# EAGLE design Clamp_Eagle_260901 (EAGLE 9.6.2)
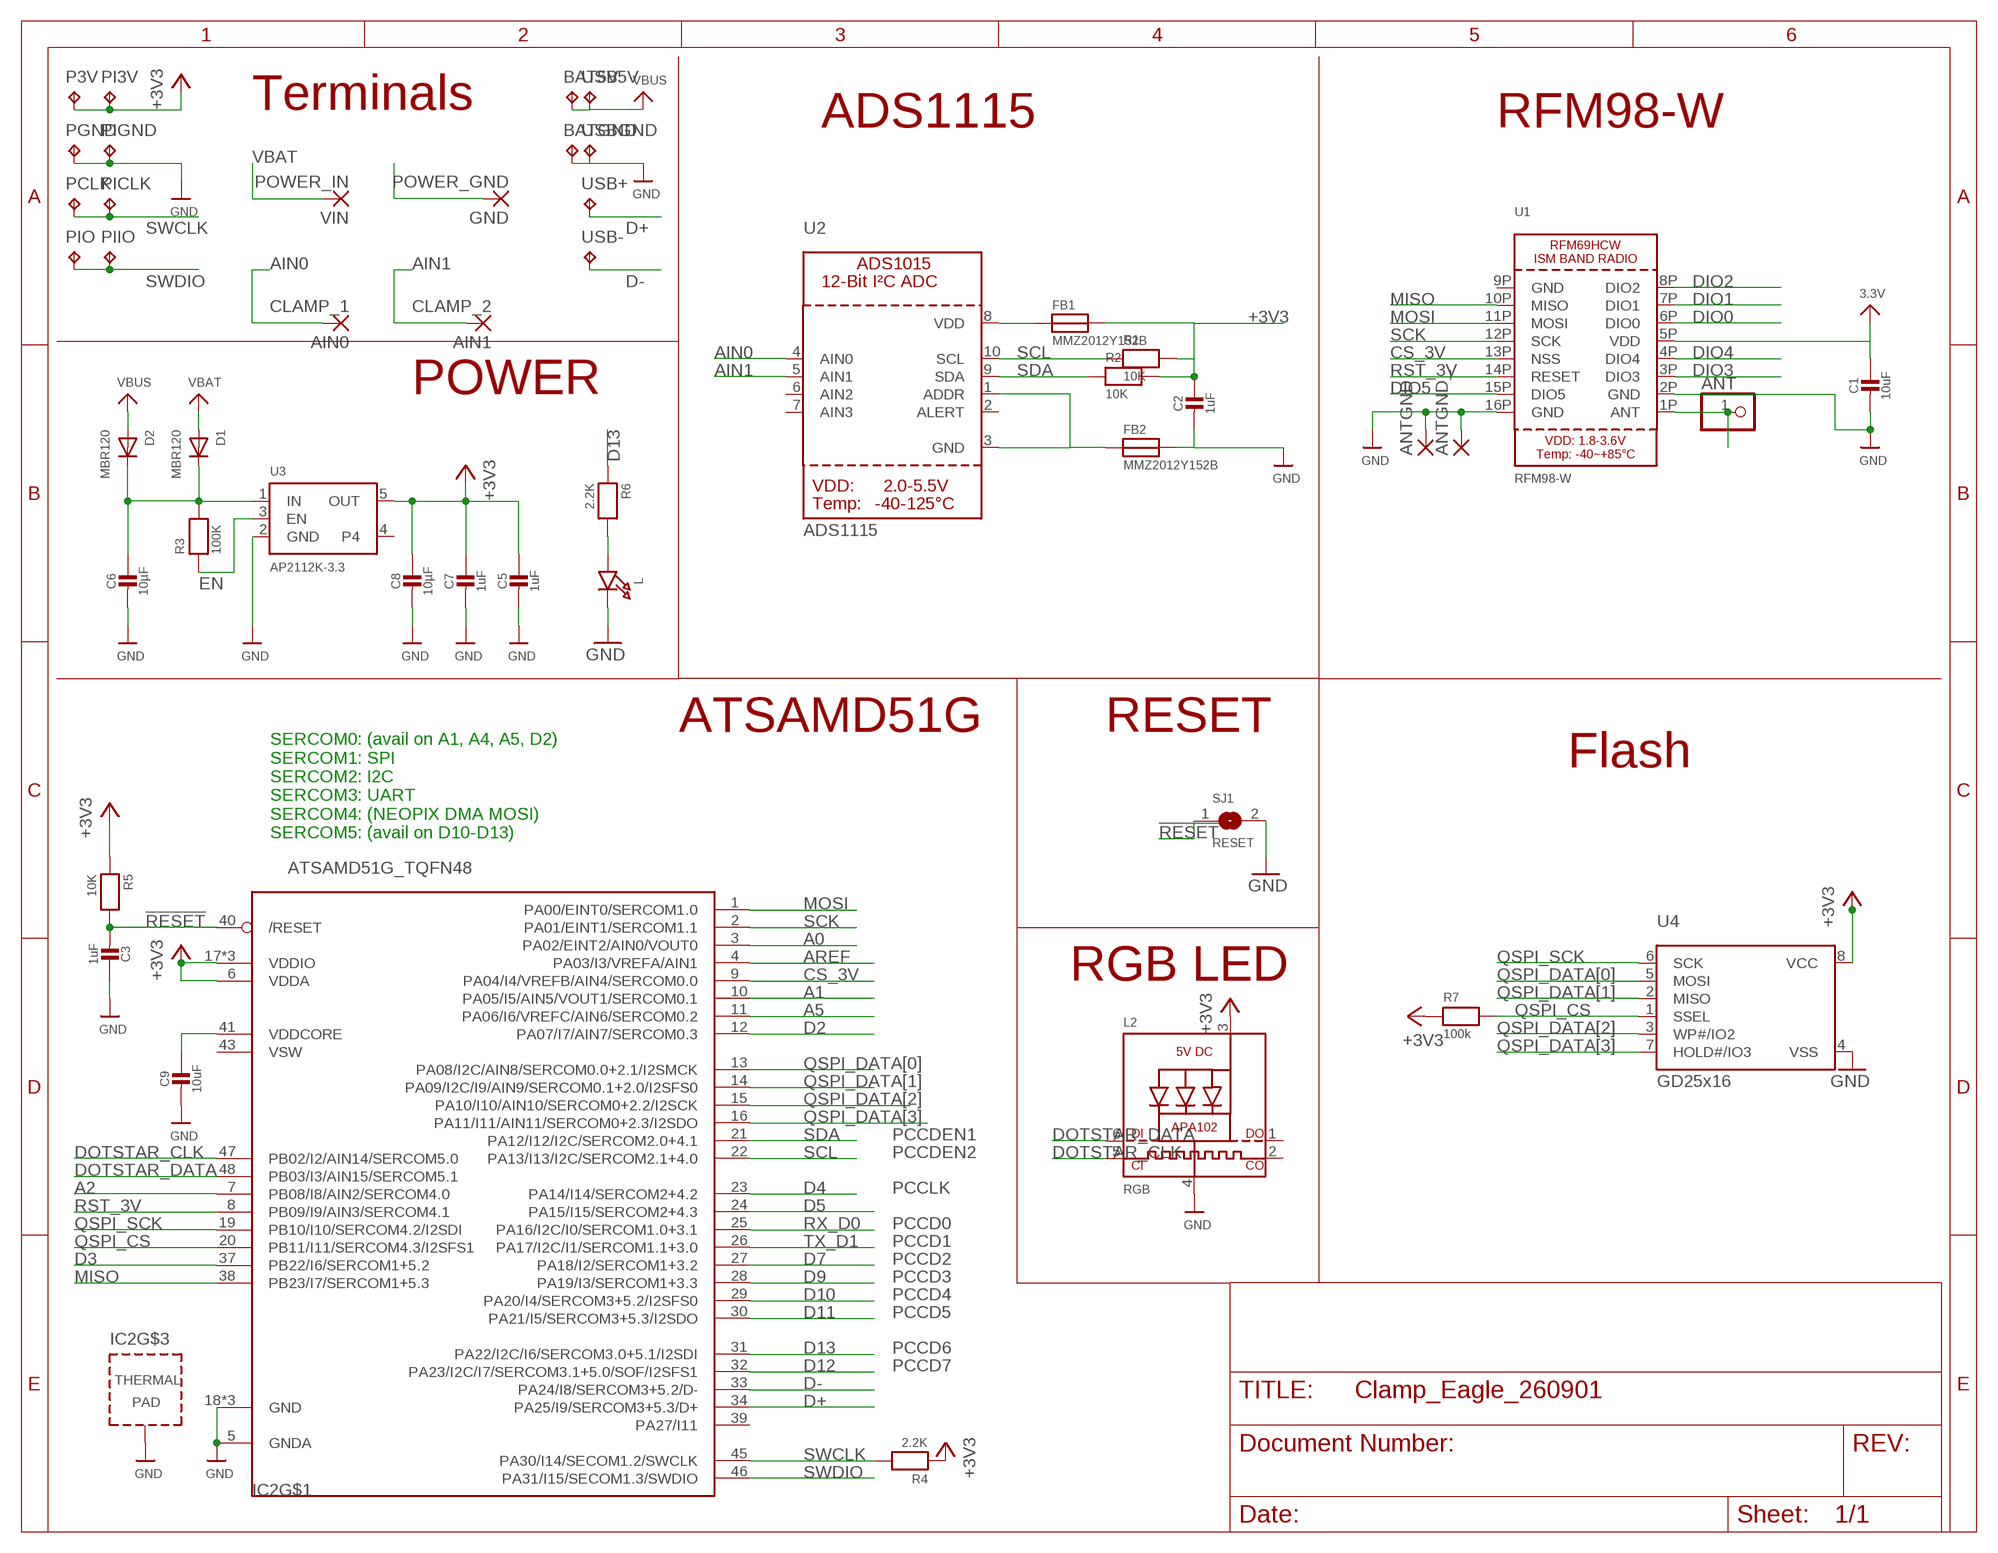
[diagram p0: schematic, sheet 1]

## Parts
AIN0  CLAMP_1  1,6/0,9  [1,6/0,9]
AIN1  CLAMP_2  1,6/0,9  [1,6/0,9]
ANT  HEADER-1X1ROUND  [1X01_ROUND]
ANTGND  SMD5  [SMD2,54-5,08]
ANTGND_  SMD5  [SMD2,54-5,08]
BAT5V  TPPAD1-13  [P1-13]
BATGND  TPPAD1-13  [P1-13]
C1  10uF  CAP_CERAMIC0805-NOOUTLINE  [0805-NO]
C2  1uF  CAP_CERAMIC0603_NO  [0603-NO]
C3  1uF  CAP_CERAMIC_0603MP  [_0603MP]
C5  1uF  CAP_CERAMIC0603_NO  [0603-NO]
C6  10µF  CAP_CERAMIC0805-NOOUTLINE  [0805-NO]
C7  1uF  CAP_CERAMIC0603_NO  [0603-NO]
C8  10µF  CAP_CERAMIC0805-NOOUTLINE  [0805-NO]
C9  10uF  CAP_CERAMIC_0805MP  [_0805MP]
D1  MBR120  DIODE_SOD-123FL  [SOD-123FL]
D2  MBR120  DIODE_SOD-123FL  [SOD-123FL]
FB1  MMZ2012Y152B  FERRITE0805  [0805]
FB2  MMZ2012Y152B  FERRITE0805  [0805]
GND  POWER_GND  1,6/0,9  [1,6/0,9]
IC2  ATSAMD51G_TQFN48  [TQFN48_7MM]
L  LED0603_NOOUTLINE  [CHIPLED_0603_NOOUTLINE]
L2  RGB  APA1022020  [APA102_2020]
P3V  TPTP20R  [TP20R]
PCLK  TPTP20R  [TP20R]
PGND  TPTP20R  [TP20R]
PI3V  TPPAD1-13  [P1-13]
PICLK  TPPAD1-13  [P1-13]
PIGND  TPPAD1-13  [P1-13]
PIIO  TPPAD1-13  [P1-13]
PIO  TPTP20R  [TP20R]
R1  10K  RESISTOR0805  [0805]
R2  10K  RESISTOR0805  [0805]
R3  100K  RESISTOR0805  [0805]
R4  2.2K  RESISTOR0805  [0805]
R5  10K  RESISTOR0805  [0805]
R6  2.2K  RESISTOR0805  [0805]
R7  100k  RESISTOR0805  [0805]
SJ1  RESET  SOLDERJUMPERCLOSED  [SOLDERJUMPER_CLOSEDWIRE]
U1  RFM98-W  RFM69HCW_SMT  [RFMHCW_SMT]
U2  ADS1115  ADC_ADS1015  [MSOP10]
U3  AP2112K-3.3  VREG_SOT23-5  [SOT23-5]
U4  GD25x16  SPIFLASH_8PINUX  [USON8]
USB5V  TPPAD1-13  [P1-13]
USB+  TPPAD1-13  [P1-13]
USB-  TPPAD1-13  [P1-13]
USBGND  TPPAD1-13  [P1-13]
VIN  POWER_IN  1,6/0,9  [1,6/0,9]

## Nets
!RESET: C3.2 IC2.40(/RESET) R5.2 SJ1.1
+3V3: C1.1 C2.1 C5.1 C7.1 C8.1 FB1.2 IC2.6(VDDA) IC2.17(VDDIO) IC2.36(VDDIO) IC2.44(VDDIO) L2.3(VDD) P3V.TP PI3V.TP R1.2 R2.2 R4.1 R5.1 R7.1 U1.5P(VDD) U3.5(OUT) U4.8(VCC) ; supply symbol labelled 3.3V
A0: IC2.3(PA02/EINT2/AIN0/VOUT0)
A1: IC2.10(PA05/I5/AIN5/VOUT1/SERCOM0.1)
A2: IC2.7(PB08/I8/AIN2/SERCOM4.0)
A5: IC2.11(PA06/I6/VREFC/AIN6/SERCOM0.2)
AIN0: AIN0.1(P) U2.4(AIN0)
AIN1: AIN1.1(P) U2.5(AIN1)
AREF: IC2.4(PA03/I3/VREFA/AIN1)
CS_3V: IC2.9(PA04/I4/VREFB/AIN4/SERCOM0.0) U1.13P(NSS)
D2: IC2.12(PA07/I7/AIN7/SERCOM0.3)
D3: IC2.37(PB22/I6/SERCOM1+5.2)
D4: IC2.23(PA14/I14/SERCOM2+4.2)
D5: IC2.24(PA15/I15/SERCOM2+4.3)
D7: IC2.27(PA18/I2/SERCOM1+3.2)
D9: IC2.28(PA19/I3/SERCOM1+3.3)
D10: IC2.29(PA20/I4/SERCOM3+5.2/I2SFS0)
D11: IC2.30(PA21/I5/SERCOM3+5.3/I2SDO)
D12: IC2.32(PA23/I2C/I7/SERCOM3.1+5.0/SOF/I2SFS1)
D13: IC2.31(PA22/I2C/I6/SERCOM3.0+5.1/I2SDI) R6.1
D+: IC2.34(PA25/I9/SERCOM3+5.3/D+) USB+.TP
D-: IC2.33(PA24/I8/SERCOM3+5.2/D-) USB-.TP
DIO0: U1.6P(DIO0)
DIO1: U1.7P(DIO1)
DIO2: U1.8P(DIO2)
DIO3: U1.3P(DIO3)
DIO4: U1.4P(DIO4)
DIO5: U1.15P(DIO5)
DOTSTAR_CLK: IC2.47(PB02/I2/AIN14/SERCOM5.0) L2.5(CKI)
DOTSTAR_DATA: IC2.48(PB03/I3/AIN15/SERCOM5.1) L2.6(DI)
EN: R3.1 U3.3(EN)
GND: ANTGND.1(P) ANTGND_.1(P) BATGND.TP C1.2 C2.2 C3.1 C5.2 C6.2 C7.2 C8.2 C9.2 FB2.2 GND.1(P) IC2.5(GNDA) IC2.18(GND) IC2.35(GND) IC2.42(GND) IC2.THERMAL(TP) L2.4(GND) L.C PGND.TP PIGND.TP SJ1.2 U1.2P(GND) U1.16P(GND) U3.2(GND) U4.4(VSS) USBGND.TP
GND_IN: FB2.1 U2.1(ADDR) U2.3(GND)
MISO: IC2.38(PB23/I7/SERCOM1+5.3) U1.10P(MISO)
MOSI: IC2.1(PA00/EINT0/SERCOM1.0) U1.11P(MOSI)
N$1: ANT.1 U1.1P(ANT)
N$2: L.A R6.2
N$3: FB1.1 U2.8(VDD)
QSPI_CS: IC2.20(PB11/I11/SERCOM4.3/I2SFS1) R7.2 U4.1(SSEL)
QSPI_DATA[0]: IC2.13(PA08/I2C/AIN8/SERCOM0.0+2.1/I2SMCK) U4.5(MOSI)
QSPI_DATA[1]: IC2.14(PA09/I2C/I9/AIN9/SERCOM0.1+2.0/I2SFS0) U4.2(MISO)
QSPI_DATA[2]: IC2.15(PA10/I10/AIN10/SERCOM0+2.2/I2SCK) U4.3(WP#/IO2)
QSPI_DATA[3]: IC2.16(PA11/I11/AIN11/SERCOM0+2.3/I2SDO) U4.7(HOLD#/IO3)
QSPI_SCK: IC2.19(PB10/I10/SERCOM4.2/I2SDI) U4.6(SCK)
RST_3V: IC2.8(PB09/I9/AIN3/SERCOM4.1) U1.14P(RESET)
RX_D0: IC2.25(PA16/I2C/I0/SERCOM1.0+3.1)
SCK: IC2.2(PA01/EINT1/SERCOM1.1) U1.12P(SCK)
SCL: IC2.22(PA13/I13/I2C/SERCOM2.1+4.0) R1.1 U2.10(SCL)
SDA: IC2.21(PA12/I12/I2C/SERCOM2.0+4.1) R2.1 U2.9(SDA)
SWCLK: IC2.45(PA30/I14/SECOM1.2/SWCLK) PCLK.TP PICLK.TP R4.2
SWDIO: IC2.46(PA31/I15/SECOM1.3/SWDIO) PIIO.TP PIO.TP
TX_D1: IC2.26(PA17/I2C/I1/SERCOM1.1+3.0)
VBAT: D1.A VIN.1(P)
VBUS: BAT5V.TP D2.A USB5V.TP
VDDCORE: C9.1 IC2.41(VDDCORE)
VHI: C6.1 D1.C D2.C R3.2 U3.1(IN)
Unconnected: IC2.39(PA27/I11) L2.1(DO) L2.2(CKO) U2.2(ALERT) U2.6(AIN2) U2.7(AIN3) U3.4

## Notes on the sheet
- Terminals
- ADS1115 | RFM98-W
- POWER
- ATSAMD51G | RESET
- Flash
- SERCOM0: (avail on A1, A4, A5, D2)
  SERCOM1: SPI
  SERCOM2: I2C
  SERCOM3: UART
  SERCOM4: (NEOPIX DMA MOSI)
  SERCOM5: (avail on D10-D13)
- RGB LED
- PCCDEN1
- PCCDEN2
- PCCLK
- PCCD0
- PCCD1
- PCCD2
- PCCD3
- PCCD4
- PCCD5
- PCCD6
- PCCD7

## Power pins joined to a net without a drawn wire
GND: U1.9P(GND)
VSW: IC2.43(VSW)

## Library data of the parts
AIN0 AIN1 GND VIN = wirepad:1,6/0,9: THROUGH-HOLE PAD
ANT = microbuilder:HEADER-1X1: PIN HEADER
ANTGND ANTGND_ = wirepad:SMD5: SMD PAD
BAT5V BATGND P3V PCLK PGND PI3V PICLK PIGND PIIO PIO USB5V USB+ USB- USBGND = testpad:TP: Test pad
C1-C3 C5-C9 = microbuilder:CAP_CERAMIC: Ceramic Capacitors For new designs, use the packages preceded by an '_' character since they are more reliable: The following footprints should be used on most boards: _0402 - Standard footprint for regular board layouts _0603 - Standard footprint for regular board layouts _0805 - Standard footprint for regular board layouts _1206 - Standard footprint for regular board layouts For extremely tight-pitch boards where space is at a premium, the following 'micro-pitch' footprints can be used (smaller pads, no silkscreen outline, etc.): _0402MP - Micro-pitch footprint for very dense/compact boards _0603MP - Micro-pitch footprint for very dense/compact boards _0805MP - Micro-pitch footprint for very dense/compact boards _1206MP - Micro-pitch footprint for very dense/compact boards
D1 D2 = adafruit:DIODE: Diode SMADIODE - SMA Surface Mount Package 20V 1A Schottky Diode Digikey: 641-1014-6-ND DO-1N4148 - Through Hole Small Current Diode SOD-123 20V 1 A (.5mV Vf) Schottky Diode - Digikey: MBRX120TPMSCT-ND SOD-323 10V 570mA (.38mV Vf, 3ns) Schottky Diode - Digikey: ZLLS410CT-ND SOD-523 30V 30mA Schottky Diode (RB751S-40TE61) - Digikey: RB751S-40TE61CT-ND SOT23-R/W - SOT23 Package (R = Solder Paste/Reflow Ovens, W = Hand-Soldering) BAT54Film 40V 300mA - Digikey: 497-7162-1-ND
FB1 FB2 = microbuilder:FERRITE: Ferrite Bead 0603 MMZ1608B121C - 120 Ohm, 600mA Ferrite Chip - Digikey: 445-2164-1-ND BK1608HW121-T - 120 Ohm, 600mA Ferrite Chip - Digikey: 587-1876-2-ND 0805 HZ0805B272R-10 - 2.7K Ohm @ 100MHz, 200mA 0.8 Ohm DC Resistance - Digikey: 240-2504-1-ND (see also Murata BLM21BD272SN1L)
IC2 = microbuilder:ATSAMD51G
L = microbuilder:LED: LED 0603 - 0603 Surface Mount Package 2mA: Green LED - Low Power (3.9mcd, 2ma, 1.7Vf) - Digikey: 475-2709-2-ND Orange LED - Low Power (9.8mcd, 2ma, 1.8Vf) - Digikey: 475-1194-2-ND Red LED - Low Power (5mcd, 2ma, 1.8Vf) - Digikey: 475-1195-2-ND Yellow LED - Low Power (7mcd, 2ma, 1.8Vf) - Digikey: 475-1196-2-ND 5mA: Blue LED - Low Power (17mcd, 5ma, 2.9Vf) - Digikey: LNJ937W8CRACT-ND 0805 - 0805 Surface Mount Package 2mA: Red LED (8.8mcd, 2mA, 1.8Vf, Clear) - Low Power [Digikey: 475-2510-1-ND] Green LED (5mcd, 2mA, 1.8Vf, Clear) - Low Power [Digikey: 475-2730-1-ND] Yellow LED (11.3mcd, 2mA, 1.8Vf, Clear) - Low Power [Digikey: 475-2555-1-ND] 20mA: Red LED (104mcd, 20mA, Diffused) - LS R976 [Digikey: 475-1278-6-ND] Red LED (12mcd, 20mA, 2.0Vf, Clear) - APT2012EC [Digikey: 754-1128-1-ND] Green LED (15mcd, 20mA, 2.2Vf, Clear) - APT2012GC [Digikey: 754-1131-1-ND] Orange LED (160mcd, 20mA, 2.1Vf, Clear) - APT2012SECK [Digikey: 754-1130-1-ND] 1206 - 1206 Surface Mount Package Green LED (26mcd, 20mA, Diffused) - LG N971 [Digikey: 475-1407-6-ND] Red LED (15mcd, 20mA, Diffused) - LH N974 [Digikey: 475-1416-6-ND] Cree - Cree High-Power Surface Mount LEDs XPEBWT-L1-0000-00D50 - White 111lm 350mA 2.9Vf 6200K 110° XTEAWT-00-0000-00000LEE3 - White 114lm 350mA 2.85Vf 5000K 115° Everlight - Everlight 45-21 Series Surface Mount LEDs 45-21/QK2C-B2832AC2CB2/2T - Warm White 2000mcd 20mA 3.25Vf 3050K 120° 45-21/LK2C-B38452C4CB2/2T - Nuetral White 2000mcd 20mA 3.25Vf 4150K 120° 45-21/LK2C-B50634C6CB2/2T - Cold White 2200mcd 20mA 3.25Vf 5650K 120° PLCC2 Reverse Mount LS T77K-J1L2-1-0-2-R18-Z - Red 11.25mcd 2mA 1.8Vf 630nm 120° LO T77K-L1M2-24-Z - Orange 19.6mcd 2mA 1.8Vf 606nm 120° LY T77K-K2M1-26-Z - Yellow 15.7mcd 2mA 1.8Vf 587nm 120°
L2 = microbuilder:APA102: APA102/DotStar Pixels VCC: 5V DC Refresh Rate: 400Hz
R1-R7 = microbuilder:RESISTOR: Resistors 0402 - 0402 Surface Mount Package 22 Ohm 1% 1/16W [Digikey: 311-22.0LRTR-ND] 33 Ohm 5% 1/16W 1.0K 5% 1/16W 1.5K 5% 1/16W 2.0K 1% 1/16W 10.0K 1% 1/16W [Digikey: 311-10.0KLRTR-ND] 10.0K 5% 1/16W [Digikey: RMCF0402JT10K0TR-ND] 12.1K 1% 1/16W [Digikey: 311-22.0LRTR-ND] 100.0K 5% 1/16W 0603 - 0603 Surface Mount Package 0 Ohm 1/10 Watt 1% Resistor 15 Ohm 1/10 Watt 1% Resistor 33 Ohm 1/10 Watt 1% Resistor 49.9 Ohm 1/10 Watt 1% Resistor 100 Ohm 1/10 Watt 1% Resistor 150 Ohm 1/10 Watt 1% Resistor 240 Ohm 1/10 Watt 1% Resistor 390 Ohm 1/10 Watt 1% Resistor 560 Ohm 1/10 Watt 1% Resistor 680 Ohm 1/10 Watt 1% Resistor 750 Ohm 1/10 Watt 1% Resistor 1.0K Ohm 1/10 Watt 1% Resistor 1.5K Ohm 1/10 Watt 1% Resistor 2.0K Ohm 1/10 Watt 1% Resistor 2.2K Ohm 1/10 Watt 1% Resistor 3.3K Ohm 1/10 Watt 1% Resistor 4.7K Ohm 1/10 Watt 1% Resistor 10.0K Ohm 1/10 Watt 1% Resistor 12.0K Ohm 1/10 Watt 1% Resistor 12.1K Ohm 1/10 Watt 1% Resistor 20.0K Ohm 1/10 Watt 1% Resistor 33.0K Ohm 1/10 Watt 1% Resistor 100.0K Ohm 1/10 Watt 1% Resistor 0805 - 0805 Surface Mount Package 0 Ohm 1/8 Watt 1% Resistor 33 Ohm 1/8 Watt 1% Resistor 100 Ohm 1/8 Watt 1% Resistor 150 Ohm 1/8 Watt 1% Resistor 200 Ohm 1/8 Watt 1% Resistor 240 Ohm 1/8 Watt 1% Resistor 330 Ohm 1/8 Watt 1% Resistor 390 Ohm 1/8 Watt 1% Resistor 470 Ohm 1/8 Watt 1% Resistor 1.0K Ohm 1/8 Watt 1% Resistor 1.5K Ohm 1/8 Watt 1% Resistor 2.0K Ohm 1/8 Watt 1% Resistor 4.7K Ohm 1/8 Watt 1% Resistor 5.1K Ohm 1/8 Watt 1% Resistor 5.6K Ohm 1/8 Watt 1% Resistor 10.0K Ohm 1/8 Watt 1% Resistor 22.0K Ohm 1/8 Watt 1% Resistor 33.0K Ohm 1/8 Watt 1% Resistor 100K Ohm 1/8 Watt 1% Resistor 1206 - 1206 Surface Mount Package 2012 - 2010 Surface Mount Package 0.11 Ohm 1/2 Watt 1% Resistor - Digikey: RHM.11UCT-ND
SJ1 = microbuilder:SOLDERJUMPER: SMD Solder JUMPER Solder the two pads together to create a connection, or remove the solder to break it. REFLOW - Use this footprint for solder paste and reflow ovens. WAVE - Use this footprint for hand-soldering (larger pads). CLOSED - Has a trace between the two pads to ensure it is closed by default. The trace needs to be cut to disable the jumper, and can be closed again by creating a solder bridge between the two pads.
U1 = microbuilder:RFM69HCW: RFM69HCW - ISM Band RF Transceiver
U2 = microbuilder:ADC_ADS1015: ADS1015 - 12-bit 4-Channel I2C ADC with Internal PGA VDD: 2.0-5.5V Sampling Rate: 3.3ksps Gain Settings: 2/3, 1, 2, 4, 8, 16 I2C Address: ADDR low = 1001000x, ADDR high = 1001001x Internal Comparator The ADS1015 includes an internal comparator that can be set to output a high-level on ALERT when the conversion results exceeeds a pre-defined upper level, and will deassert itself when the level falls below a pre-defined lower threshold level. It can also be set to windowed mode where the ALERT pin will be asserted if the data exceeds the upper threshold or falls below the lower threshold.
U3 = microbuilder:VREG_SOT23-5: SOT23-5 Fixed Voltage Regulators Part Current Out V Out V In V Dropout θJA (°C/W) TJ (°C) Digikey Part No. ADP121 150mA 3.3V 3.4-5.5V 0.09V @ 150mA -- -- ADP121-AUJZ33R7CT-ND ADP121 150mA 3.0V 3.1-5.5V 0.09V @ 150mA -- -- ADP121-AUJZ30R7CT-ND ADP122 300mA 3.3V 3.4-5.5V 0.085V @ 300mA -- -- ADP122AUJZ-3.3-R7CT-ND ADP1712 300mA 3.3V 3.5-5.5V 0.17V @ 300mA -- -- ADP1712AUJZ-3.3-R7TR-ND AP7311 (Low Cost) 150mA 3.3V 3.5-6V 0.15V @ 150mA -- -- AP7311-33WG-7DICT-ND LD39015M18R 150mA 1.8V 1.9V-5.5V 0.08V @ 100mA -- -- 497-6977-1-ND LP2985A-33DBVR 150mA 3.3V 3.3-16V 0.28V @ 150mA 206 150 296-18479-1-ND MCP1824T-3302E/OT 300mA 3.3V 3.5V-6V 0.2V @ 300mA -- -- MCP1824T-3302E/OTCT-ND MIC5205-2.5YM5 TR 150mA 2.5V 2.7-16V 0.165V @ 150mA -- -- 576-1257-2-ND MIC5205-3.0YM5 TR 150mA 3.0V 3.2V-16V 0.165V @ 150mA -- -- 576-1258-2-ND MIC5205-3.3YM5 TR 150mA 3.3V 3.5V-16V 0.165V @ 150mA -- -- 576-1259-2-ND TPS780330220 150mA 3.3V+2.2V 3.6-5.5V 250mV Max -- -- 296-23332-1-ND TDA3663/N1,135 100mA 3.3V 3.5-45V 0.18V @ 50mA -- -- 568-5343-1-ND Max operating temp can be calculated using θJA, TJ (max junction temperature), and power in watts. Set the "Maximum Ambient Temperature" until it reaches TJ ("Max Junction Temperature"), which is the absolute limit for safe use of the regulator: Heat Sink Temperature Calculator <http://www.daycounter.com/Calculators/Heat-Sink-Temperature-Calculator.phtml> For example, With 12V source into a 3.3V LP2985 and a 30mA load, we are dissipating (12V-3.3V) * 0.03A = 0.261W. With a θJA of 206 °C/W, a TJ of 150°C, and 261mW we can safely use the chip without a heat sink up to 75°C (=147.1°C Junction Temperature).
U4 = microbuilder:SPIFLASH_8PIN: SOIC8 SPI Flash Be careful with the size since SOIC8 flash comes in several 'widths' SOIC8 150 mil M25P16 - 16Mbit (2Mbit x 8) Serial Flash (75MHz SPI Bus), Supply: 2.7-3.6V Digikey: SOIC8 - M25P16-VMN6P-ND SOIC8 208 mil W25Q16BVSSIG - 16Mbit (2Mbit x 8) Serial Flash (104MHz SPI Bus), Supply: 2.7-3.6V Digikey: SOIC8 - W25Q16BVSSIG-ND

## Board
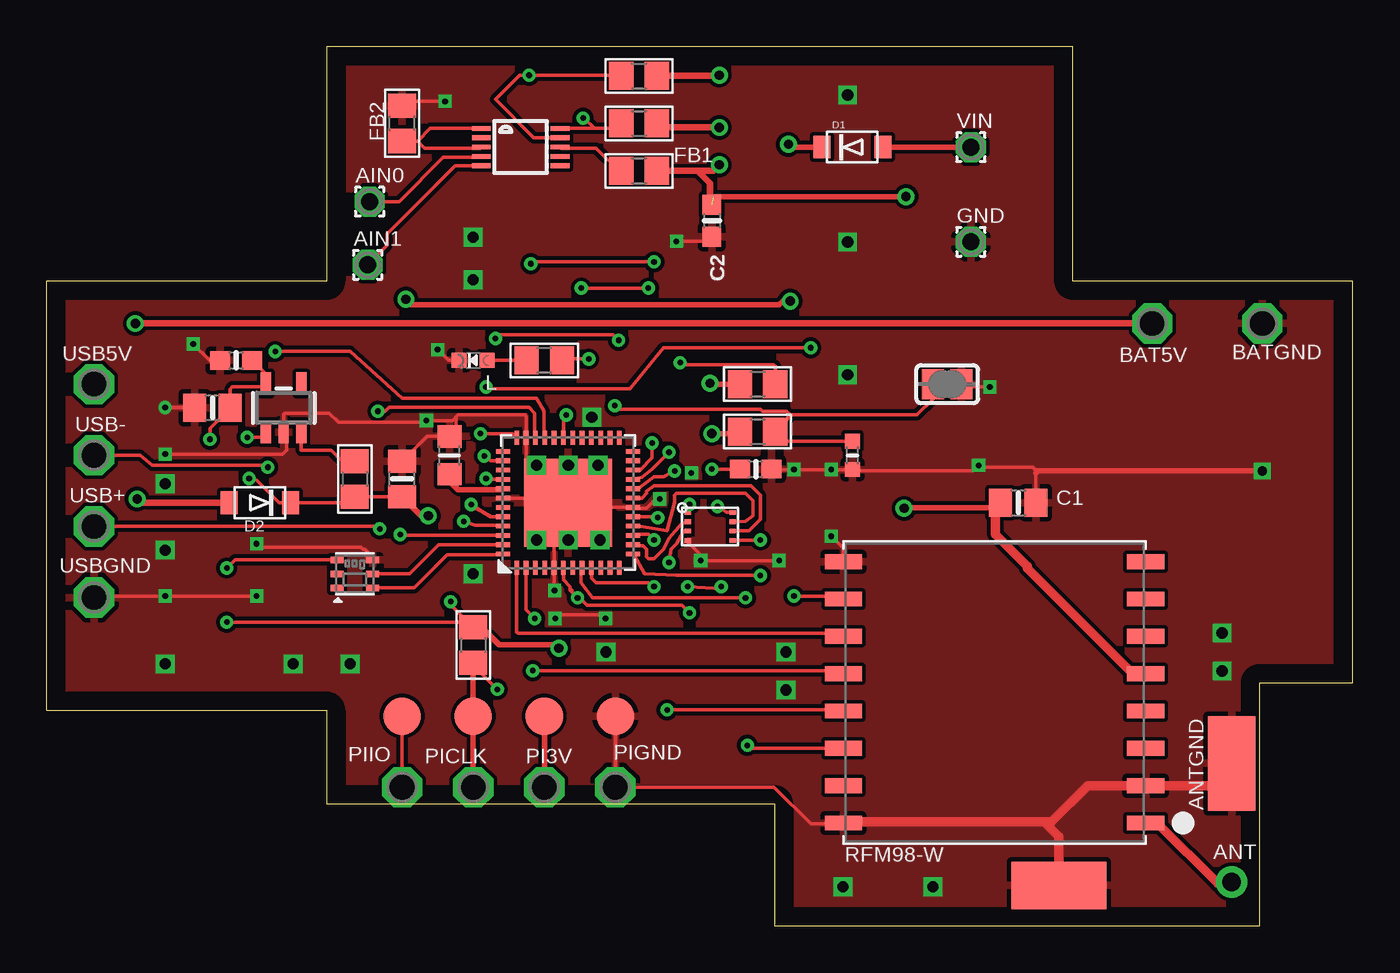
[diagram p1: board, top side]
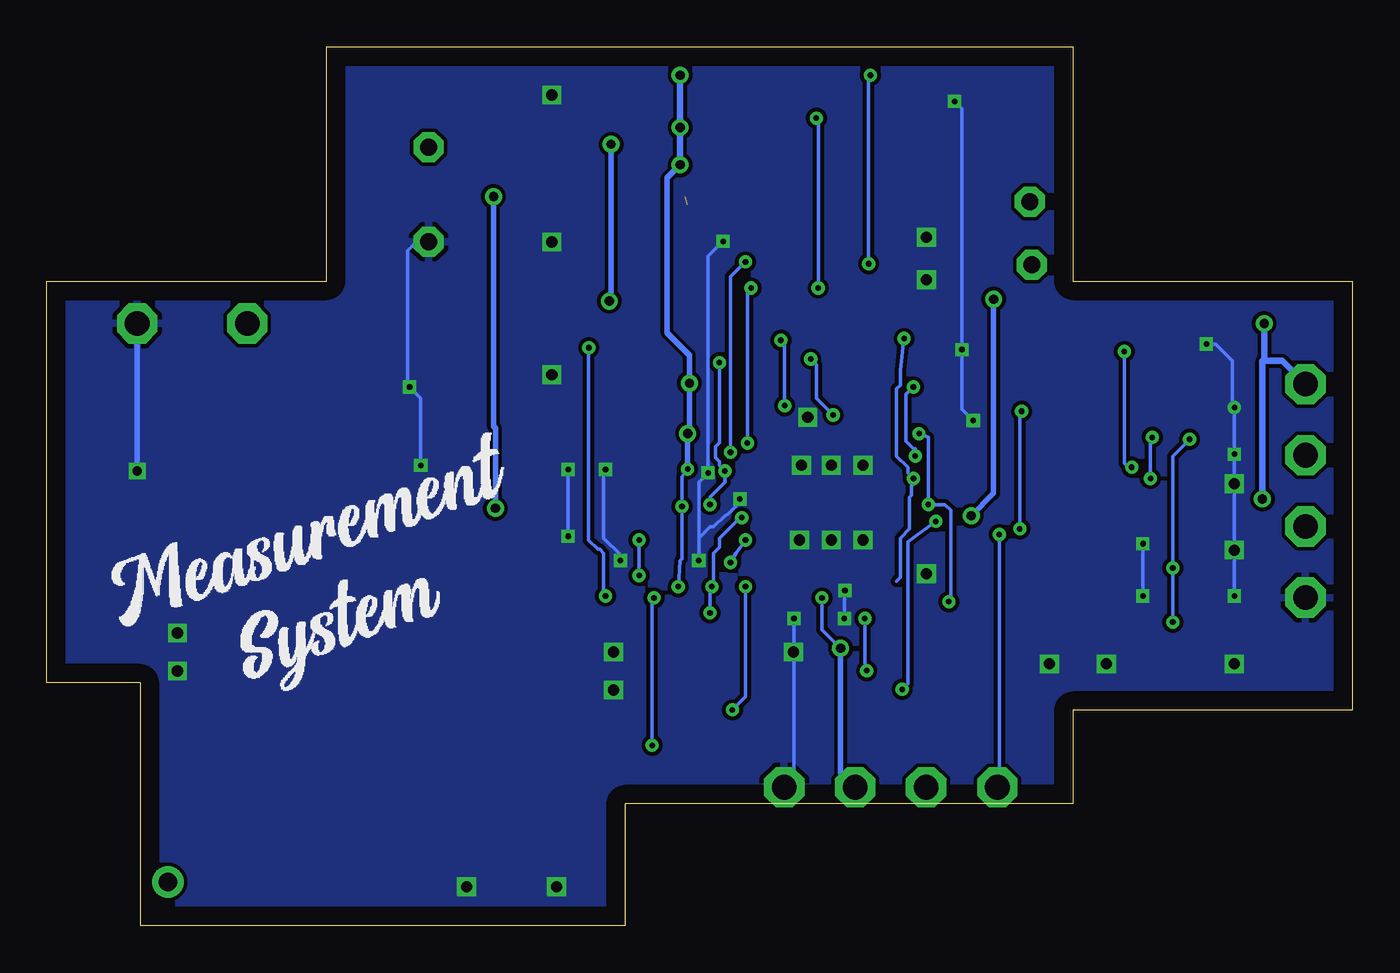
[diagram p2: board, bottom side, seen from below]

Size 70 x 47.1 mm. Coordinates in mm from the lower left corner, seen from the top.
Outline: 64.99,0 39,0 39,6.54 15,6.54 15,11.54 0,11.54 0,34.54 15,34.54 15,47.1 55,47.1 55,34.54 70,34.54 70,13.02 64.99,13.02 64.99,0
Outline: 64.99,0 65,0
Copper layers (1*16): Top 0.035mm / dielectric 1.5mm / Bottom 0.035mm
Design rules "default": minimum track width 10mil, minimum drill 24mil, track to track 8mil, track to pad 8mil, pad to pad 8mil, via to via 8mil, smd to smd 8mil, copper to edge 40mil, drill to drill 8mil, minimum pad ring 10mil, minimum via ring 8mil, stop-mask expansion 4mil, vias tented up to drill 0mil, thermal gap 10mil

### Footprints (pad centres in the part's own frame; a part is rotated, then mirrored left to right if it is on the bottom)
1,6/0,9 = drill 0.914 pad 1.6 octagon: 1 0,0
1X01_ROUND = drill 1 pad 1.676: 1 0,0
SMD2,54-5,08 = smd 2.54 x 5.08: 1 0,0
P1-13 = drill 1.321 pad 2.159 octagon: TP 0,0
0805-NO = smd 1.24 x 1.5: 1 -0.95,0; 2 0.95,0
0603-NO = smd 1.075 x 1: 1 -0.85,0; 2 0.85,0
_0603MP = smd 0.8 x 0.8: 1 -0.762,0; 2 0.762,0
_0805MP = smd 1.2 x 1.3: 1 -1.016,0; 2 1.016,0
SOD-123FL = smd 0.91 x 1.22: A 1.637,0; C -1.637,0
0805 = smd 1.3 x 1.5: 1 -0.95,0; 2 0.95,0
TQFN48_7MM = smd 0.25 x 0.75: 1 -2.75,-3.475; 2 -2.25,-3.475; 3 -1.75,-3.475; 4 -1.25,-3.475; 5 -0.75,-3.475; 6 -0.25,-3.475; 7 0.25,-3.475; 8 0.75,-3.475; 9 1.25,-3.475; 10 1.75,-3.475; 11 2.25,-3.475; 12 2.75,-3.475; 25 2.75,3.475; 26 2.25,3.475; 27 1.75,3.475; 28 1.25,3.475; 29 0.75,3.475; 30 0.25,3.475; 31 -0.25,3.475; 32 -0.75,3.475; 33 -1.25,3.475; 34 -1.75,3.475; 35 -2.25,3.475; 36 -2.75,3.475 | smd 0.75 x 0.25: 13 3.475,-2.75; 14 3.475,-2.25; 15 3.475,-1.75; 16 3.475,-1.25; 17 3.475,-0.75; 18 3.475,-0.25; 19 3.475,0.25; 20 3.475,0.75; 21 3.475,1.25; 22 3.475,1.75; 23 3.475,2.25; 24 3.475,2.75; 37 -3.475,2.75; 38 -3.475,2.25; 39 -3.475,1.75; 40 -3.475,1.25; 41 -3.475,0.75; 42 -3.475,0.25; 43 -3.475,-0.25; 44 -3.475,-0.75; 45 -3.475,-1.25; 46 -3.475,-1.75; 47 -3.475,-2.25; 48 -3.475,-2.75 | smd 4.7 x 4.7: THERMAL 0,0
CHIPLED_0603_NOOUTLINE = smd 0.8 x 0.8: A 0,-0.75; C 0,0.75
APA102_2020 = smd 0.7 x 0.35: 1 -0.95,-0.75; 2 -0.95,0; 3 -0.95,0.75; 4 0.95,0.75; 5 0.95,0; 6 0.95,-0.75
TP20R = smd 2 x 2: TP 0,0
SOLDERJUMPER_CLOSEDWIRE = smd 1.168 x 1.6: 1 -0.762,0; 2 0.762,0 | smd 0.635 x 0.203: WIRE 0,0
RFMHCW_SMT = smd 2 x 0.8: 1P 8.1,-7; 2P 8.1,-5; 3P 8.1,-3; 4P 8.1,-1; 5P 8.1,1; 6P 8.1,3; 7P 8.1,5; 8P 8.1,7; 9P -8.1,7; 10P -8.1,5; 11P -8.1,3; 12P -8.1,1; 13P -8.1,-1; 14P -8.1,-3; 15P -8.1,-5; 16P -8.1,-7
MSOP10 = smd 0.25 x 1: 1 -1,-2.113; 2 -0.5,-2.113; 3 0,-2.113; 4 0.5,-2.113; 5 1,-2.113; 6 1,2.113; 7 0.5,2.113; 8 0,2.113; 9 -0.5,2.113; 10 -1,2.113
SOT23-5 = smd 0.55 x 1.2: 1 -0.95,-1.3; 2 0,-1.3; 3 0.95,-1.3; 4 0.95,1.3; 5 -0.95,1.3
USON8 = smd 0.35 x 0.25: 1 -1.2,0.75; 2 -1.2,0.25; 3 -1.2,-0.25; 4 -1.2,-0.75; 5 1.2,-0.75; 6 1.2,-0.25; 7 1.2,0.25; 8 1.2,0.75

### Placement (x,y rotation side)
AIN0  17.31,38.8 0 top
AIN1  17.21,35.41 0 top
ANT  63.5,2.35 0 top
ANTGND  63.5,8.7 0 top
ANTGND_  54.25,2.17 90 top
BAT5V  59.25,32.27 0 top
BATGND  65.15,32.27 0 top
C1  52.07,22.67 0 top
C2  35.65,37.77 270 top
C3  43.18,25.21 90 top
C5  38,24.47 0 top
C6  19.05,23.94 90 top
C7  10.16,30.29 180 top
C8  8.89,27.75 180 top
C9  21.59,25.21 90 top
D1  43.18,41.72 0 top
D2  11.43,22.67 180 top
FB1  31.75,40.45 0 top
FB2  19.05,42.99 90 top
GND  49.53,36.64 0 top
IC2  27.94,22.67 0 top
L  22.86,30.29 90 top
L2  16.51,18.86 0 top
P3V  26.67,11.24 0 top
PCLK  22.86,11.24 0 top
PGND  30.48,11.24 0 top
PI3V  26.67,7.43 0 top
PICLK  22.86,7.43 0 top
PIGND  30.48,7.43 0 top
PIIO  19.05,7.43 0 top
PIO  19.05,11.24 0 top
R1  31.75,42.99 0 top
R2  31.75,45.53 0 top
R3  16.51,23.94 270 top
R4  22.86,15.05 270 top
R5  38.1,26.48 0 top
R6  26.67,30.29 180 top
R7  38.1,29.02 0 top
SJ1  48.26,29.02 0 top
U1  50.8,12.51 0 top
U2  25.4,41.72 270 top
U3  12.7,27.75 0 top
U4  35.56,21.4 0 top
USB5V  2.54,29.02 0 top
USB+  2.54,21.4 0 top
USB-  2.54,25.21 0 top
USBGND  2.54,17.59 0 top
VIN  49.53,41.72 0 top

### Tracks (layer width: path | path; a pad name or v marks a point on that pad's centre or on a via)
!RESET  (via drill 0.3)
  Top 0.2: IC2.40 23.6,23.92 v23.55,23.97 | SJ1.1 47.5,28.22 46.65,27.37 39.94,27.37 R5.2 | C3.2 39.56,25.97 R5.2 | R5.2 39.05,26.57 39.85,27.37 39.65,27.57 38.35,27.57 38.25,27.67 30.65,27.67 v30.45,27.87 | v30.65,31.37 30.35,31.67 24.25,31.67 v24.05,31.47
  Bottom 0.2: 24.45,18.47 24.25,18.67 24.25,20.77 23.75,21.27 23.75,22.97 23.65,23.07 23.65,23.57 23.55,23.67 v23.55,23.97 23.85,24.27 23.85,24.57 24.45,25.17 24.45,28.77 24.25,28.97 24.25,29.77 v24.05,31.47 | v30.45,27.87 30.45,31.17 v30.65,31.37
+3V3  (via drill 0.3, 0.5)  (1 unrouted)
  Top 0.2: U4.8 36.43,22.15 v35.95,22.47 | v35.65,24.47 C5.1 | v8.75,26.07 8.75,26.66 C8.1 9.84,28.76 9.95,28.87 11.57,28.87 U3.5 11.75,29.55 C7.1 | L2.3 10.09,19.61 v9.65,19.17 | v9.65,16.27 22.59,16.27 R4.1 21.65,17.21 v21.65,17.37 | 23.8,21.92 v22.75,22.57 22.75,22.47 23.75,21.97 23.8,21.92 | v23.25,26.37 24.97,26.37 IC2.36 | 28.05,18.07 28.05,17.97 v28.45,17.57 | IC2.17 32.7,21.92 v32.75,21.87 | v34.35,18.17 36.25,18.07 v36.15,18.17 | 28.05,18.07 28.15,17.97 28.15,17.87 v28.45,17.57 | IC2.6 27.69,18.53 28.05,18.17 28.05,18.07 | v28.45,17.57 28.55,17.57 28.95,17.17 34.05,17.17 v34.45,16.77 | IC2.44 23.8,21.92 | C2.1 35.55,38.62 35.55,38.87
  Top 0.3: R4.1 23.32,16 24.25,15.07 27.25,15.07 v27.45,14.87 | P3V.TP PI3V.TP | R7.1 35.6,29.02 v35.55,29.07 | 36.55,26.37 37.04,26.37 R5.1 36.66,26.48 36.55,26.37 | 36.55,26.37 v35.65,26.37 | 50.85,22.4 45.98,22.4 v45.95,22.37 | v46.05,39.07 35.77,39.07
  Top 0.35: R2.2 36.01,45.53 v36.05,45.57 | v36.05,42.77 32.92,42.77 R1.2 | 35.55,38.87 35.55,39.77 34.87,40.45 FB1.2 35.73,40.45 v36.05,40.77
  Top 0.5: U1.5P 58.21,13.51 52.55,19.17 52.55,19.27 50.85,20.97 50.85,22.4 C1.1
  Bottom 0.2: v36.15,18.17 36.05,19.57 35.95,19.67 35.95,22.37 | 35.95,22.37 35.95,24.07 v35.65,24.47 | v8.75,26.07 9.65,25.17 v9.65,19.17 v9.65,16.27 | v23.25,26.37 22.75,26.17 v22.75,22.57 21.85,22.57 21.55,22.27 21.55,17.47 v21.65,17.37 | v28.45,17.57 28.45,15.87 v27.45,14.87 | v32.75,21.87 32.85,21.87 33.95,20.77 33.95,20.27 34.25,19.97 34.25,18.17 v34.35,18.17 34.45,18.07 v34.45,16.77 | v35.95,22.47 36.05,22.47 35.95,22.37
  Bottom 0.3: v27.45,14.87 27.45,8.21 PI3V.TP | v35.65,24.47 v35.65,26.37 35.55,26.47 v35.55,29.07 35.55,30.57 36.75,31.77 36.75,40.07 v36.05,40.77 | v45.95,22.37 45.95,26.67 46.05,26.77 v46.05,39.07
  Bottom 0.35: v36.05,45.57 v36.05,42.77 v36.05,40.77
AIN0
  Top 0.2: AIN0.1 18.88,38.8 21.25,41.17 23.24,41.17 U2.4
AIN1
  Top 0.2: U2.5 21.9,40.72 18.25,37.07 18.25,36.45 AIN1.1
CS_3V  (via drill 0.3)
  Top 0.2: IC2.9 29.19,18.63 29.45,18.37 32.25,18.37 v32.55,18.17 | v33.25,11.57 42.64,11.57 U1.13P
  Bottom 0.2: v32.55,18.17 32.55,12.27 v33.25,11.57
D13  (via drill 0.3)
  Top 0.2: IC2.31 27.69,27.21 v27.85,27.37 | v29.05,30.37 27.7,30.37 R6.1
  Bottom 0.2: v27.85,27.37 28.75,28.27 28.75,30.07 v29.05,30.37
D+  (via drill 0.3)
  Top 0.2: USB+.TP 18.08,21.4 v17.85,21.27 | v17.75,27.57 18.15,27.57 18.35,27.77 25.85,27.77 26.15,27.47 26.15,26.18 IC2.34
  Bottom 0.2: v17.85,21.27 17.85,27.47 v17.75,27.57
D-  (via drill 0.3)
  Top 0.2: USB-.TP 5.01,25.21 5.65,24.67 11.75,24.67 v11.85,24.57 | v12.25,30.77 16.25,30.77 19.05,28.27 26.25,28.27 26.65,27.57 26.65,26.18 IC2.33
  Bottom 0.2: v11.85,24.57 12.05,24.57 12.25,24.77 v12.25,30.77
DOTSTAR_CLK
  Top 0.2: IC2.47 21,20.42 19.45,18.87 L2.5
DOTSTAR_DATA
  Top 0.2: L2.6 19.69,18.11 21.45,19.87 24.41,19.87 IC2.48
EN
  Top 0.2: R3.1 15.83,24.89 15.25,25.47 13.65,25.47 U3.3
GND  (via drill 0.3, 0.5, 0.6)
  Top 0.2: U4.4 34.36,20.56 35.05,19.87 v35.05,19.57 v39.25,19.57 | IC2.THERMAL 27.15,21.88 27.15,20.87 27.19,20.83 IC2.5 27.19,18.13 | IC2.42 27.69,22.92 IC2.THERMAL | 28.45,22.42 IC2.18 31.46,22.37 32.15,22.37 32.55,22.77 32.75,22.77 v32.85,22.87 | 28.45,22.42 28.19,22.42 IC2.THERMAL | 28.45,22.42 27,23.87 26.35,23.87 25.69,24.53 IC2.35 25.69,27.31 25.65,27.37 22.05,27.37 21.95,27.27 | v26.25,20.67 26.25,20.98 IC2.THERMAL | v27.95,20.67 IC2.THERMAL | v29.65,20.67 29.65,20.96 IC2.THERMAL | v27.95,24.67 IC2.THERMAL | v29.55,24.67 29.55,24.28 IC2.THERMAL | v26.25,24.67 26.25,24.36 IC2.THERMAL | 21.95,27.27 21.95,26.59 C9.2 20.39,26.23 C6.2 | 27.19,18.13 v27.22,17.96 | v27.22,17.96 27.25,17.77 | v29.95,16.47 29.85,16.67 27.45,16.67 v27.25,16.47 | PGND.TP PIGND.TP 38.99,7.43 40.95,5.47 42.66,5.47 U1.16P | C7.2 8.73,30.29 v7.85,31.17 | USBGND.TP 2.62,17.67 v6.35,17.67 v11.25,17.67 | L.C 21.53,30.29 v20.95,30.87 | 21.95,27.27 21.75,27.07 v20.35,27.07 20.15,26.97 15.65,26.97 15.15,27.47 12.75,27.47 12.7,27.42 U3.2 12.85,26.3 12.85,25.47 12.65,25.27 v6.35,25.27 | v21.35,44.17 19.28,44.17 FB2.2 | v33.75,36.67 35.27,36.67 35.27,36.92 C2.2 | L2.4 17.46,19.76 17.05,20.17 16.95,20.17 16.85,20.27 11.45,20.27 v11.25,20.47 | C5.2 38.87,24.45 v40.05,24.45 v42.05,24.45 C3.1 43.03,24.45 42.95,24.37 49.65,24.37 v49.95,24.67 50.05,24.57 52.85,24.57 53.02,24.4 53.02,24.27 C1.2 | U1.9P 42.7,20.22 v42.05,20.87 | v50.55,28.87 49.17,28.87 SJ1.2 | v27.22,17.96 27.22,18.1 27.19,18.13 | v6.35,27.77 7.92,27.77 C8.2 6.37,27.75 v6.35,27.77
  Top 0.3: v65.15,24.37 53.12,24.37 53.02,24.27
  Top 0.5: ANTGND.1 62.31,7.51 U1.2P 55.79,7.51 53.85,5.57 53.45,5.57 | 53.45,5.57 42.76,5.57 U1.16P | ANTGND_.1 54.25,4.77 53.45,5.57
  Bottom 0.2: 35.05,20.77 35.05,23.77 v34.55,24.27 34.55,35.87 v33.75,36.67 | v29.95,16.47 29.95,7.96 PIGND.TP | v7.85,31.17 7.35,31.17 6.45,30.27 6.45,27.87 v6.35,27.77 v6.35,25.27 v6.35,17.67 | v20.35,27.07 20.95,27.67 v20.95,30.87 20.95,43.77 v21.35,44.17 | v32.85,22.87 33.05,22.67 33.05,22.47 33.45,22.07 33.65,21.97 34.25,21.37 34.45,21.37 35.05,20.77 | v11.25,20.47 v11.25,17.67 | v42.05,20.87 v42.05,24.45 | v49.95,24.67 49.95,28.27 v50.55,28.87 50.65,28.97 50.65,36.17 50.18,36.64 GND.1 | v27.25,16.47 27.25,17.93 v27.22,17.96 | 35.05,20.77 v35.05,19.57 | v39.25,19.57 39.25,19.87 40.15,20.77 40.15,24.35 v40.05,24.45
  Bottom 0.3: BATGND.TP v65.15,24.37
  other vias: 42.93,36.64 42.93,29.53 42.67,2.1 47.5,2.1 6.35,14.03 13.21,14.03 16.26,14.03 22.86,36.89 22.86,34.61 42.93,44.51 29.21,27.24 22.86,18.86 29.97,14.67 39.62,14.67 39.62,12.64 62.99,13.65 62.99,15.68 6.35,20.13 6.35,23.69
  pour Top: 37.85,-0.95 37.85,5.65 -0.76,5.65 -0.76,35.37 14.48,35.37 14.48,48.32 55.88,48.32 55.88,35.37 70.87,35.37 70.87,12 65.79,12 65.79,-0.95
  pour Bottom: 37.85,-0.95 37.85,5.65 -0.76,5.65 -0.76,35.37 14.48,35.37 14.48,48.32 55.88,48.32 55.88,35.37 70.87,35.37 70.87,12 65.79,12 65.79,-0.95
GND_IN
  Top 0.2: FB2.1 19.88,42.04 | 19.88,42.04 20.25,41.67 23.24,41.67 U2.3 | U2.1 20.56,42.72 19.88,42.04
MISO  (via drill 0.3)
  Top 0.2: IC2.38 23.8,24.92 23.55,25.17 v23.45,25.17 | v23.55,28.87 23.65,28.87 23.75,28.77 31.25,28.77 33.05,30.97 v40.95,30.97 | v40.05,17.67 42.54,17.67 U1.10P
  Bottom 0.2: v23.45,25.17 23.45,25.57 23.55,25.57 23.95,25.97 23.95,28.47 v23.55,28.87 | v40.95,30.97 40.95,20.67 40.45,20.17 40.35,20.17 40.15,19.97 40.15,17.77 v40.05,17.67
MOSI
  Top 0.2: IC2.1 25.19,15.73 25.25,15.67 42.54,15.67 U1.11P
N$1
  Top 0.5: U1.1P 59.51,5.51 62.75,2.27 63.42,2.27 ANT.1
N$2
  Top 0.2: R6.2 L.A
N$3
  Top 0.2: FB1.1 30.67,40.45 29.45,41.67 27.56,41.67 U2.8
QSPI_CS  (via drill 0.3)
  Top 0.2: IC2.20 31.7,23.42 32.55,24.07 33.05,24.07 v33.65,24.37 | U4.1 34.36,22.48 v34.45,22.57 | R7.2 39.05,29.97 38.95,30.07 34.05,30.07 v33.95,30.17
  Bottom 0.2: v34.45,22.57 34.45,22.97 33.65,23.77 v33.65,24.37 33.95,24.67 33.95,24.87 34.15,25.07 34.15,25.67 33.95,25.87 v33.95,30.17
QSPI_DATA[0]  (via drill 0.3)
  Top 0.2: U4.5 38.23,20.65 v38.25,20.67 | v38.25,18.77 33.75,18.77 32.05,18.87 31.46,19.87 IC2.13
  Bottom 0.2: v38.25,20.67 v38.25,18.77
QSPI_DATA[1]
  Top 0.2: U4.2 34.03,21.55 33.35,20.77 33.05,20.17 32.55,19.67 32.25,19.67 32.15,19.77 32.15,20.17 31.95,20.37 31.46,20.37 IC2.14
QSPI_DATA[2]  (via drill 0.3)
  Top 0.2: U4.3 34.13,21.15 33.75,20.47 33.45,20.17 v33.35,19.47 | v32.55,20.67 32.25,20.97 31.46,20.97 IC2.15
  Bottom 0.2: v33.35,19.47 33.05,19.97 v32.55,20.67
QSPI_DATA[3]
  Top 0.2: IC2.16 31.8,21.42 33.25,21.17 33.65,22.67 33.65,23.07 33.75,23.17 37.45,23.17 37.85,22.77 37.85,21.97 37.44,21.67 U4.7
QSPI_SCK
  Top 0.2: IC2.19 31.9,22.92 32.15,23.17 32.15,23.27 32.55,23.57 37.75,23.57 38.25,23.07 38.25,21.77 37.65,21.17 36.78,21.17 U4.6
RST_3V  (via drill 0.3)
  Top 0.2: U1.14P 37.71,9.51 v37.55,9.67 | v37.45,17.57 29.25,17.57 28.65,18.37 28.65,19.16 IC2.8
  Bottom 0.2: v37.55,9.67 37.55,17.47 v37.45,17.57
SCK  (via drill 0.3)
  Top 0.2: IC2.2 25.69,16.93 v26.15,16.47 | v26.05,13.67 42.54,13.67 U1.12P
  Bottom 0.2: v26.15,16.47 26.15,13.77 v26.05,13.67
SCL  (via drill 0.3)
  Top 0.2: U2.10 29.35,42.72 | 29.35,42.72 30.53,42.72 R1.1 | IC2.22 31.8,24.42 32.45,25.07 v32.45,25.87 | v32.25,34.17 v28.65,34.17 | v28.75,43.27 28.8,43.27 29.35,42.72
  Bottom 0.2: v32.45,25.87 32.45,33.97 v32.25,34.17 | v28.65,34.17 28.65,43.17 v28.75,43.27
SDA  (via drill 0.3)
  Top 0.2: U2.9 26.1,42.22 24.05,44.27 25.35,45.57 v25.85,45.57 26.25,45.57 30.76,45.57 R2.1 | IC2.21 31.9,24.02 32.45,24.47 v33.35,25.37 | v32.55,35.57 26.05,35.57 v25.95,35.47
  Bottom 0.2: v33.35,25.37 33.35,34.77 v32.55,35.57 | v25.95,35.47 25.95,45.47 v25.85,45.57
SWCLK  (via drill 0.3)
  Top 0.2: R4.2 22.86,13.96 v24.15,12.67 | v22.35,21.67 22.95,21.47 24.41,21.47 IC2.45
  Top 0.3: PICLK.TP PCLK.TP R4.2
  Bottom 0.2: v24.15,12.67 23.85,12.97 23.85,20.57 v22.35,21.67
SWDIO  (via drill 0.3)
  Top 0.2: IC2.46 19,20.92 v18.95,20.97 | PIO.TP PIIO.TP
  Bottom 0.2: v18.95,20.97 18.95,7.53 PIIO.TP
VBAT
  Top 0.3: VIN.1 D1.A
VBUS  (via drill 0.5)
  Top 0.35: BAT5V.TP v4.75,32.27 | D2.A 5.05,22.67 v4.85,22.87
  Bottom 0.35: v4.75,32.27 4.75,30.37 | 4.75,30.37 4.75,30.27 3.79,30.27 USB5V.TP | v4.85,22.87 4.85,30.27 4.75,30.37
VDDCORE
  Top 0.2: C9.1 21.59,23.83 | 24.41,23.37 IC2.41
  Top 0.3: 21.59,23.83 22.05,23.37 24.41,23.37
VHI  (via drill 0.3, 0.5)
  Top 0.2: C6.1 R3.2 16.19,22.67 D2.C 12.45,22.67 11.25,23.87 v10.85,23.97 | v10.75,26.17 11.47,26.17 U3.1
  Top 0.3: D1.C 39.9,41.72 v39.75,41.87 | v39.85,33.47 39.45,33.47 39.25,33.27 19.55,33.27 v19.25,33.57 | v20.45,21.97 20.07,21.97 C6.1
  Bottom 0.2: v10.85,23.97 10.85,26.07 v10.75,26.17
  Bottom 0.3: v39.75,41.87 39.75,33.57 v39.85,33.47 | v19.25,33.57 19.25,23.17 v20.45,21.97